# EAGLE design tricorder (EAGLE 6.4)
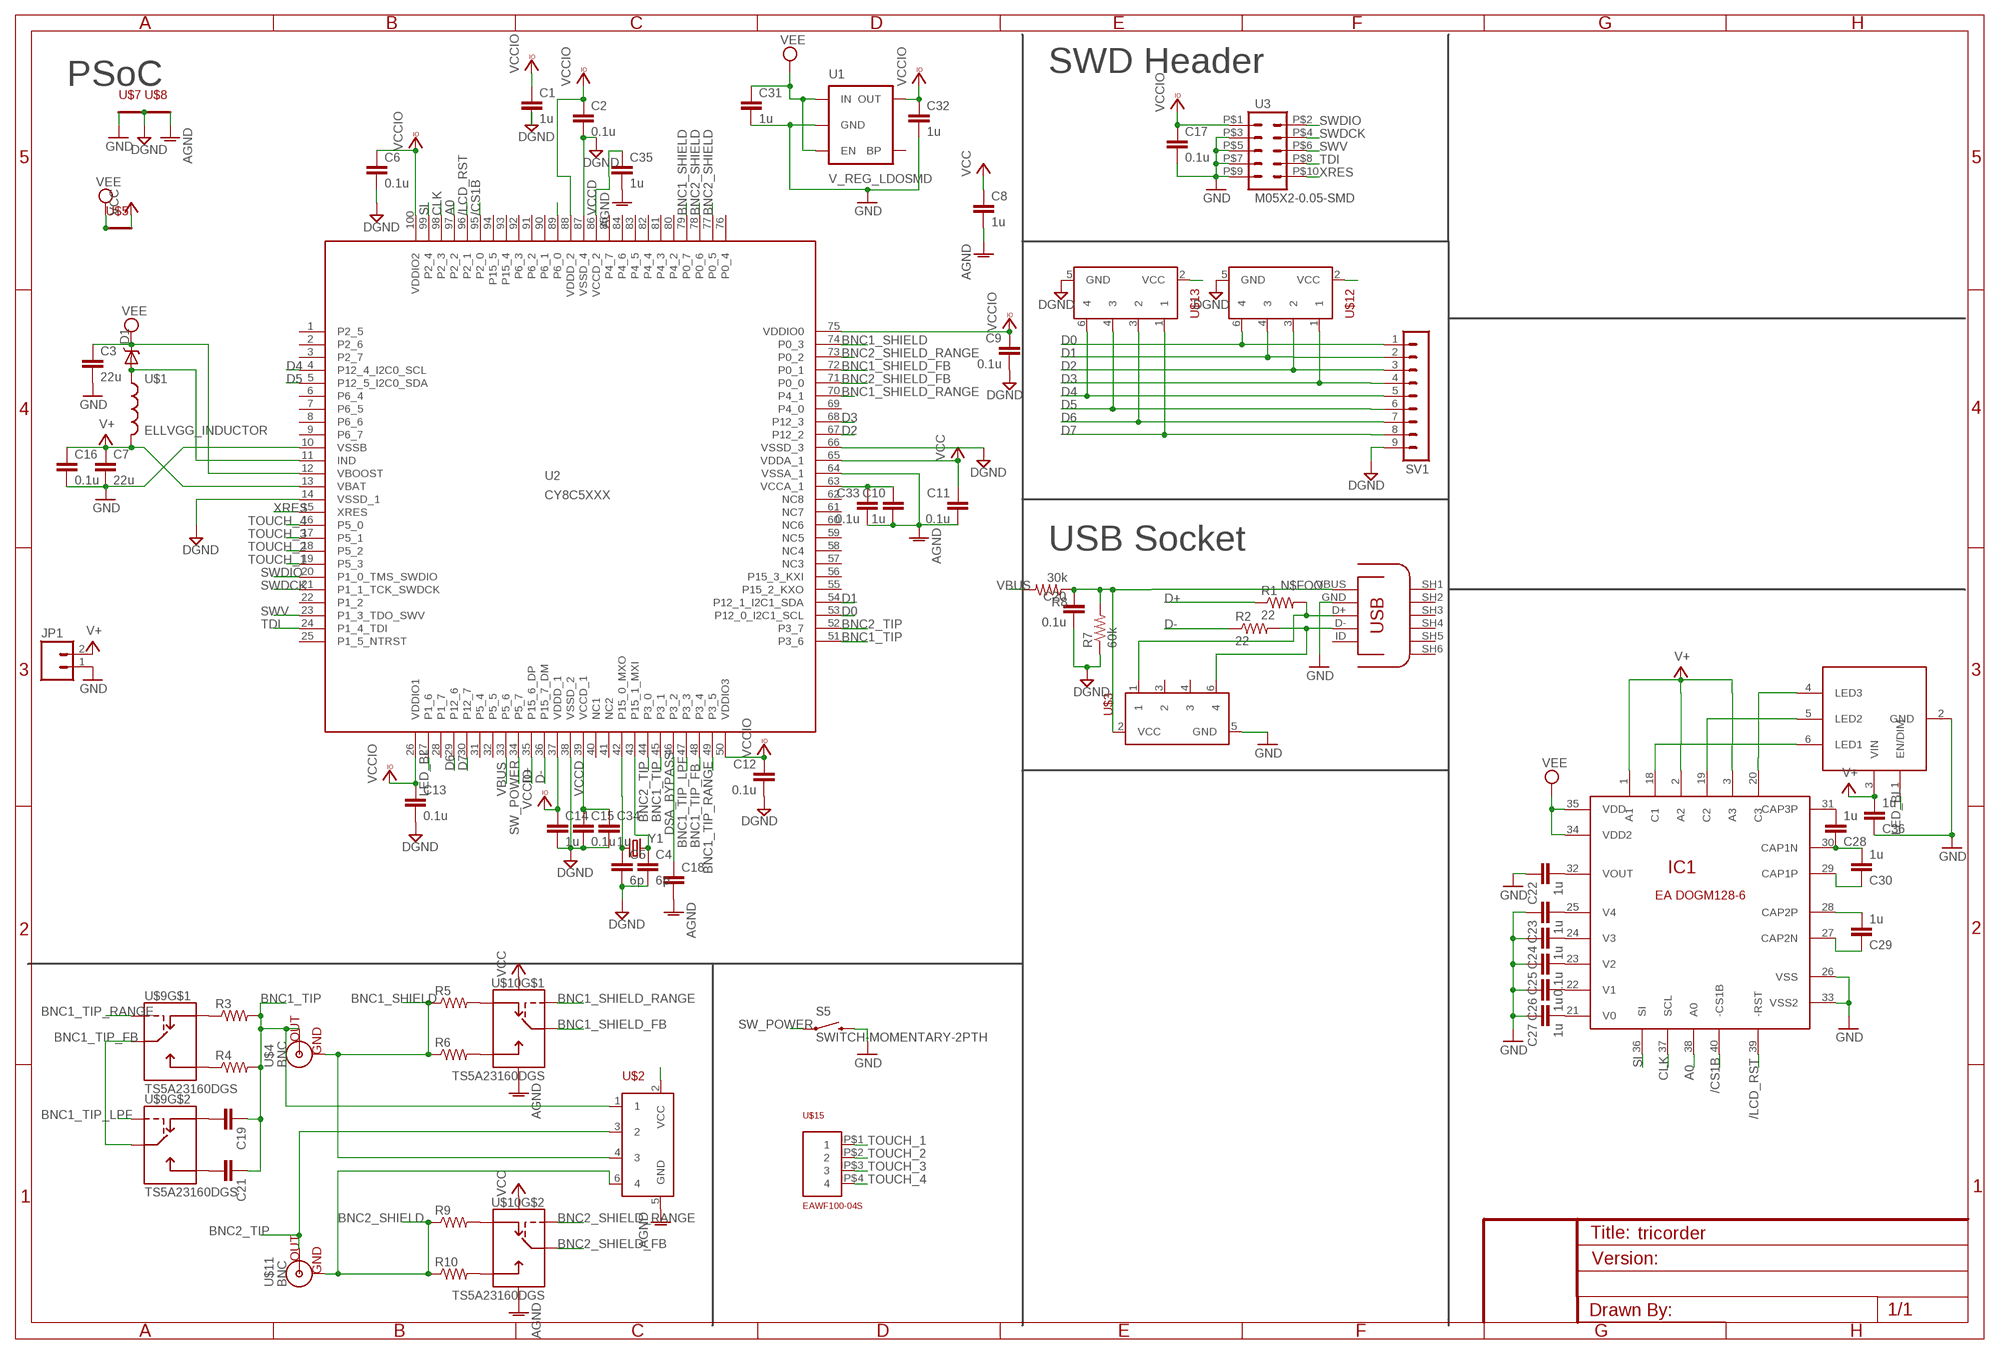
[diagram p0: schematic, sheet 1]

## Parts
C1  1u  CAP0603-CAP  [0603-CAP]
C2  0.1u  CAP0603-CAP  [0603-CAP]
C3  22u  CAP0805  [0805]
C4  6p  CAP0603-CAP  [0603-CAP]
C5  6p  CAP0603-CAP  [0603-CAP]
C6  0.1u  C-EUC0603K  [C0603K]
C7  22u  CAP0805  [0805]
C8  1u  CAP0603-CAP  [0603-CAP]
C9  0.1u  CAP0603-CAP  [0603-CAP]
C10  1u  CAP0603-CAP  [0603-CAP]
C11  0.1u  CAP0603-CAP  [0603-CAP]
C12  0.1u  C-EUC0603K  [C0603K]
C13  0.1u  C-EUC0603K  [C0603K]
C14  1u  CAP0603-CAP  [0603-CAP]
C15  0.1u  CAP0603-CAP  [0603-CAP]
C16  0.1u  CAP0603-CAP  [0603-CAP]
C17  0.1u  C-EUC0603K  [C0603K]
C18  CAP0805  [0805]
C19  CAP0603-CAP  [0603-CAP]
C20  0.1u  CAP0603-CAP  [0603-CAP]
C21  CAP0603-CAP  [0603-CAP]
C22  1u  C-EUC0603K  [C0603K]
C23  1u  C-EUC0603K  [C0603K]
C24  1u  C-EUC0603K  [C0603K]
C25  0.1u  C-EUC0603K  [C0603K]
C26  1u  C-EUC0603K  [C0603K]
C27  1u  C-EUC0603K  [C0603K]
C28  1u  C-EUC0603K  [C0603K]
C29  1u  C-EUC0603K  [C0603K]
C30  1u  C-EUC0603K  [C0603K]
C31  1u  CAP0603-CAP  [0603-CAP]
C32  1u  CAP0603-CAP  [0603-CAP]
C33  0.1u  CAP0603-CAP  [0603-CAP]
C34  1u  CAP0603-CAP  [0603-CAP]
C35  1u  CAP0603-CAP  [0603-CAP]
C36  1u  C-EUC0603K  [C0603K]
D1  DIODE-SCHOTTKY_  [SMA-DIODE]
IC1  EADOGM128  [EADOGM128]
JP1  M02PTH  [1X02]
R1  22  RESISTOR0603-RES  [0603-RES]
R2  22  RESISTOR0603-RES  [0603-RES]
R3  RESISTOR0603-RES  [0603-RES]
R4  RESISTOR0603-RES  [0603-RES]
R5  RESISTOR0603-RES  [0603-RES]
R6  RESISTOR0603-RES  [0603-RES]
R7  60k  RESISTOR0603-RES  [0603-RES]
R8  30k  RESISTOR0603-RES  [0603-RES]
R9  RESISTOR0603-RES  [0603-RES]
R10  RESISTOR0603-RES  [0603-RES]
S5  SWITCH-MOMENTARY-2PTH  [TACTILE-PTH]
SV1  MA09-1W  [MA09-1W]
U1  V_REG_LDOSMD  [SOT23-5]
U2  CY8C5XXX  CY8C3XXX-100PIN  [TQFP-14X14-100]
U3  M05X2-0.05-SMD  [PINHD-2X5-0.05-SMD]
U7  MICROUSB  [USB-MICROB]
U$1  ELLVGG_INDUCTOR  [ELLVGG_INDUCTOR]
U$2  ESD5V3U4RRSSOT363  [SOT363_INFINEON]
U$3  ESD5V3U4RRSSOT363  [SOT363_INFINEON]
U$4  BNC  [BNC_RA]
U$5  SHORT-2  [SHORT-2]
U$7  SHORT-2  [SHORT-2]
U$8  SHORT-2  [SHORT-2]
U$9  TS5A23160DGS  [MSOP10]
U$10  TS5A23160DGS  [MSOP10]
U$11  BNC  [BNC_RA]
U$12  ESD5V3U4RRSSOT363  [SOT363_INFINEON]
U$13  ESD5V3U4RRSSOT363  [SOT363_INFINEON]
U$15  EAWF100-04S  [EAWF100-04S]
U$16  CAT4003B  [SOT23-6]
Y1  XRCGB_XTAL  [XRCGB-XTAL]

## Nets
/CS1B: IC1.40(-CS1B) U2.95(P2_0)
/LCD_RST: IC1.39(-RST) U2.96(P2_1)
A0: IC1.38(A0) U2.97(P2_2)
AGND: C8.2 C10.2 C11.2 C18.2 C33.2 C35.2 U2.64(VSSA_1) U$2.5(GND) U$8.P$2 U$9.3(GND) U$10.3(GND)
BNC1_SHIELD: R5.1 R6.1 U2.74(P0_3) U2.79(P0_7) U$2.4 U$4.SHIELD_1(GND) U$4.SHIELD_2(GND)
BNC1_SHIELD_FB: U2.72(P0_1) U$10.10(COM)
BNC1_SHIELD_RANGE: U2.70(P4_1) U$10.1(IN)
BNC1_TIP: C19.1 C21.1 R3.2 R4.2 U2.45(P3_1) U2.51(P3_6) U$2.1 U$4.TIP(OUT)
BNC1_TIP_FB: U2.48(P3_4) U$9.6(COM) U$9.10(COM)
BNC1_TIP_LPF: U2.47(P3_3) U$9.5(IN)
BNC1_TIP_RANGE: U2.49(P3_5) U$9.1(IN)
BNC2_SHIELD: R9.1 R10.1 U2.77(P0_5) U2.78(P0_6) U$2.6 U$11.SHIELD_1(GND) U$11.SHIELD_2(GND)
BNC2_SHIELD_FB: U2.71(P0_0) U$10.6(COM)
BNC2_SHIELD_RANGE: U2.73(P0_2) U$10.5(IN)
BNC2_TIP: U2.44(P3_0) U2.52(P3_7) U$2.3 U$11.TIP(OUT)
CLK: IC1.37(SCL) U2.98(P2_3)
CLKI: C4.1 U2.43(P15_1_MXI) Y1.2
CLKO: C5.1 U2.42(P15_0_MXO) Y1.1
D0: SV1.1 U2.53(P12_0_I2C1_SCL) U$12.6
D1: SV1.2 U2.54(P12_1_I2C1_SDA) U$12.4
D2: SV1.3 U2.67(P12_2) U$12.3
D3: SV1.4 U2.68(P12_3) U$12.1
D4: SV1.5 U2.4(P12_4_I2C0_SCL) U$13.6
D5: SV1.6 U2.5(P12_5_I2C0_SDA) U$13.4
D6: SV1.7 U2.29(P12_6) U$13.3
D7: SV1.8 U2.30(P12_7) U$13.1
D+: R1.1 U2.35(P15_6_DP)
D+IN: R1.2 U7.D+ U$3.1
D-: R2.1 U2.36(P15_7_DM)
D-IN: R2.2 U7.D- U$3.6
DGND: C1.2 C2.2 C4.2 C5.2 C6.2 C9.2 C12.2 C13.2 C14.2 C15.2 C20.2 C34.2 R7.1 SV1.9 U2.14(VSSD_1) U2.38(VSSD_2) U2.66(VSSD_3) U2.87(VSSD_4) U$7.P$2 U$8.P$1 U$12.5(GND) U$13.5(GND)
DSA_BYPASS: C18.1 U2.46(P3_2)
GND: C3.2 C7.2 C16.2 C17.2 C22.1 C23.1 C24.1 C25.1 C26.1 C27.1 C31.2 C32.2 C36.1 IC1.26(VSS) IC1.33(VSS2) JP1.1 S5.3 U1.2(GND) U2.10(VSSB) U3.P$3 U3.P$5 U3.P$7 U3.P$9 U7.GND U$3.5(GND) U$7.P$1 U$16.2(GND)
LED_BL: U2.27(P1_6) U$16.1(EN/DIM)
N$1: R3.1 U$9.9(NC)
N$2: R4.1 U$9.2(NO)
N$3: C10.1 C33.1 U2.63(VCCA_1)
N$4: R5.2 U$10.9(NC)
N$5: R6.2 U$10.2(NO)
N$6: C19.2 U$9.7(NC)
N$7: C21.2 U$9.4(NO)
N$8: R9.2 U$10.7(NC)
N$9: R10.2 U$10.4(NO)
N$10: C22.2 IC1.32(VOUT)
N$11: C23.2 IC1.25(V4)
N$12: C24.2 IC1.24(V3)
N$13: C25.2 IC1.23(V2)
N$14: C26.2 IC1.22(V1)
N$15: C27.2 IC1.21(V0)
N$16: C28.1 C30.2 IC1.30(CAP1N)
N$17: C28.2 IC1.31(CAP3P)
N$18: C30.1 IC1.29(CAP1P)
N$19: C29.2 IC1.28(CAP2P)
N$21: C29.1 IC1.27(CAP2N)
N$22: IC1.18(C1) U$16.6(LED1)
N$23: IC1.19(C2) U$16.5(LED2)
N$25: IC1.20(C3) U$16.4(LED3)
N$26: D1.A U2.11(IND) U$1.P$1
N$FOO: C20.1 R7.2 R8.1 U7.VBUS(VCC) U$3.2(VCC)
NC1: U$13.2(VCC)
NC2: U$12.2(VCC)
NC3: U$2.2(VCC)
SI: IC1.36(SI) U2.99(P2_4)
SW_MENU: U2.89(P6_0)
SW_POWER: S5.1 U2.34(P5_7)
SWDCK: U2.21(P1_1_TCK_SWDCK) U3.P$4
SWDIO: U2.20(P1_0_TMS_SWDIO) U3.P$2
SWV: U2.23(P1_3_TDO_SWV) U3.P$6
TDI: U2.24(P1_4_TDI) U3.P$8
TOUCH_1: U2.19(P5_3) U$15.P$1
TOUCH_2: U2.18(P5_2) U$15.P$2
TOUCH_3: U2.17(P5_1) U$15.P$3
TOUCH_4: U2.16(P5_0) U$15.P$4
V+: C7.1 C16.1 C36.2 IC1.1(A1) IC1.2(A2) IC1.3(A3) JP1.2 U2.13(VBAT) U$1.P$2 U$16.3(VIN)
VBUS: R8.2 U2.33(P5_6)
VCC: C8.1 C11.1 U2.65(VDDA_1) U$5.P$2 U$9.8(VCC) U$10.8(VCC)
VCCD: C15.1 C34.1 C35.1 U2.39(VCCD_1) U2.86(VCCD_2)
VCCIO: C1.1 C2.1 C6.1 C9.1 C12.1 C13.1 C14.1 C17.1 C32.1 U1.5(OUT) U2.26(VDDIO1) U2.37(VDDD_1) U2.50(VDDIO3) U2.75(VDDIO0) U2.88(VDDD_2) U2.100(VDDIO2) U3.P$1
VEE: C3.1 C31.1 D1.C IC1.34(VDD2) IC1.35(VDD) U1.1(IN) U1.3(EN) U2.12(VBOOST) U$5.P$1
XRES: U2.15(XRES) U3.P$10
Unconnected: U1.4(BP) U2.1(P2_5) U2.2(P2_6) U2.3(P2_7) U2.6(P6_4) U2.7(P6_5) U2.8(P6_6) U2.9(P6_7) U2.22(P1_2) U2.25(P1_5_NTRST) U2.28(P1_7) U2.31(P5_4) U2.32(P5_5) U2.40(NC1) U2.41(NC2) U2.55(P15_2_KXO) U2.56(P15_3_KXI) U2.57(NC3) U2.58(NC4) U2.59(NC5) U2.60(NC6) U2.61(NC7) U2.62(NC8) U2.69(P4_0) U2.76(P0_4) U2.80(P4_2) U2.81(P4_3) U2.82(P4_4) U2.83(P4_5) U2.84(P4_6) U2.85(P4_7) U2.90(P6_1) U2.91(P6_2) U2.92(P6_3) U2.93(P15_4) U2.94(P15_5) U7.ID U7.SH1(SH) U7.SH2(SH) U7.SH3(SH) U7.SH4(SH) U7.SH5(SH) U7.SH6(SH) U$3.3 U$3.4

## Notes on the sheet
- SWD Header
- PSoC
- USB Socket

## Library data of the parts
C1-C5 C7-C11 C14-C16 C18-C21 C31-C35 = SparkFun-Passives:CAP: Capacitor Standard 0603 ceramic capacitor, and 0.1" leaded capacitor.
C6 C12 C13 C17 C22-C30 C36 = resistor:C-EU: CAPACITOR, European symbol
D1 = SparkFun-DiscreteSemi:DIODE-SCHOTTKY: Commonly MBRA140.
IC1 = ea-dogm:EADOGM128
JP1 = SparkFun-Connectors:M02: Header 2 Standard 2-pin 0.1" header. Use with straight break away headers (SKU : PRT-00116), right angle break away headers (PRT-00553), swiss pins (PRT-00743), machine pins (PRT-00117), and female headers (PRT-00115). Molex polarized connector foot print use with SKU : PRT-08233 with associated crimp pins and housings.
R1-R10 = SparkFun-Passives:RESISTOR: Resistor Basic schematic elements and footprints for 0603, 1206, and PTH resistors.
S5 = SparkFun-Electromechanical:SWITCH-MOMENTARY-2: Various NO switches- pushbuttons, reed, etc
SV1 = con-lstb:MA09-1W: PIN HEADER; OC_FARNELL: unknown; OC_NEWARK: unknown
U1 = SparkFun-PowerIC:V_REG_LDO: Voltage Regulator LDO Standard 150mA LDO voltage regulator in SOT-23 layout. Micrel part MIC5205. BP (by-pass) pin is used to lower output noise with 470pF cap.
U2 = cypress_psoc_V1_0:CY8C3XXX-100PIN: Cypress PSoC® 3 - Programmable System on Chip, 8051 Based Source Data: http://www.cypress.com/?mpn=CY8C3866AXI-040T LBR Source: http://www.westmarkelectronics.com Thomas W. Moxon Director of Engineering www.westmarkelectronics.com; MPN: CY8C3866AXI-040
U3 = nickparts:M05X2-0.05-SMD
U7 = ondraster:MICROUSB
U$1 = Ava:ELLVGG_INDUCTOR
U$2 U$3 U$12 U$13 = nickparts:ESD5V3U4RRS
U$4 U$11 = nickparts:BNC
U$5 U$7 U$8 = nickparts:SHORT-2
U$9 U$10 = nickparts:TS5A23160
U$15 = ea-dogm:EAWF100-04S
U$16 = nickparts:CAT4003B
Y1 = nickparts:XRCGB_XTAL

## Board
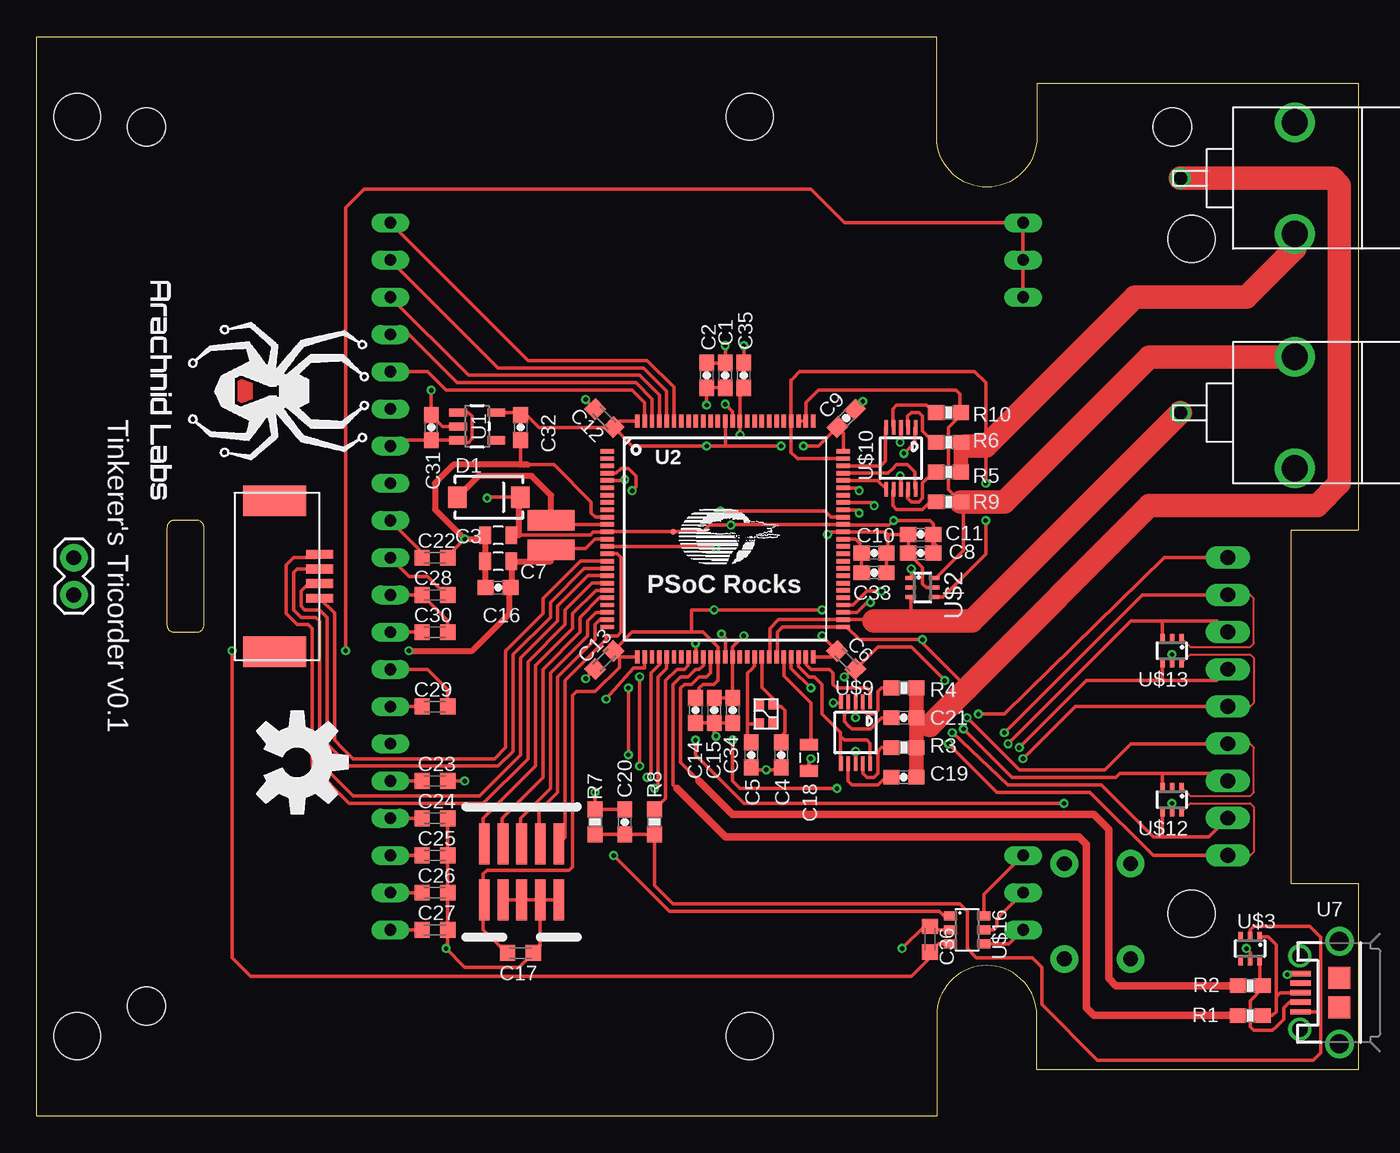
[diagram p1: board, top side]
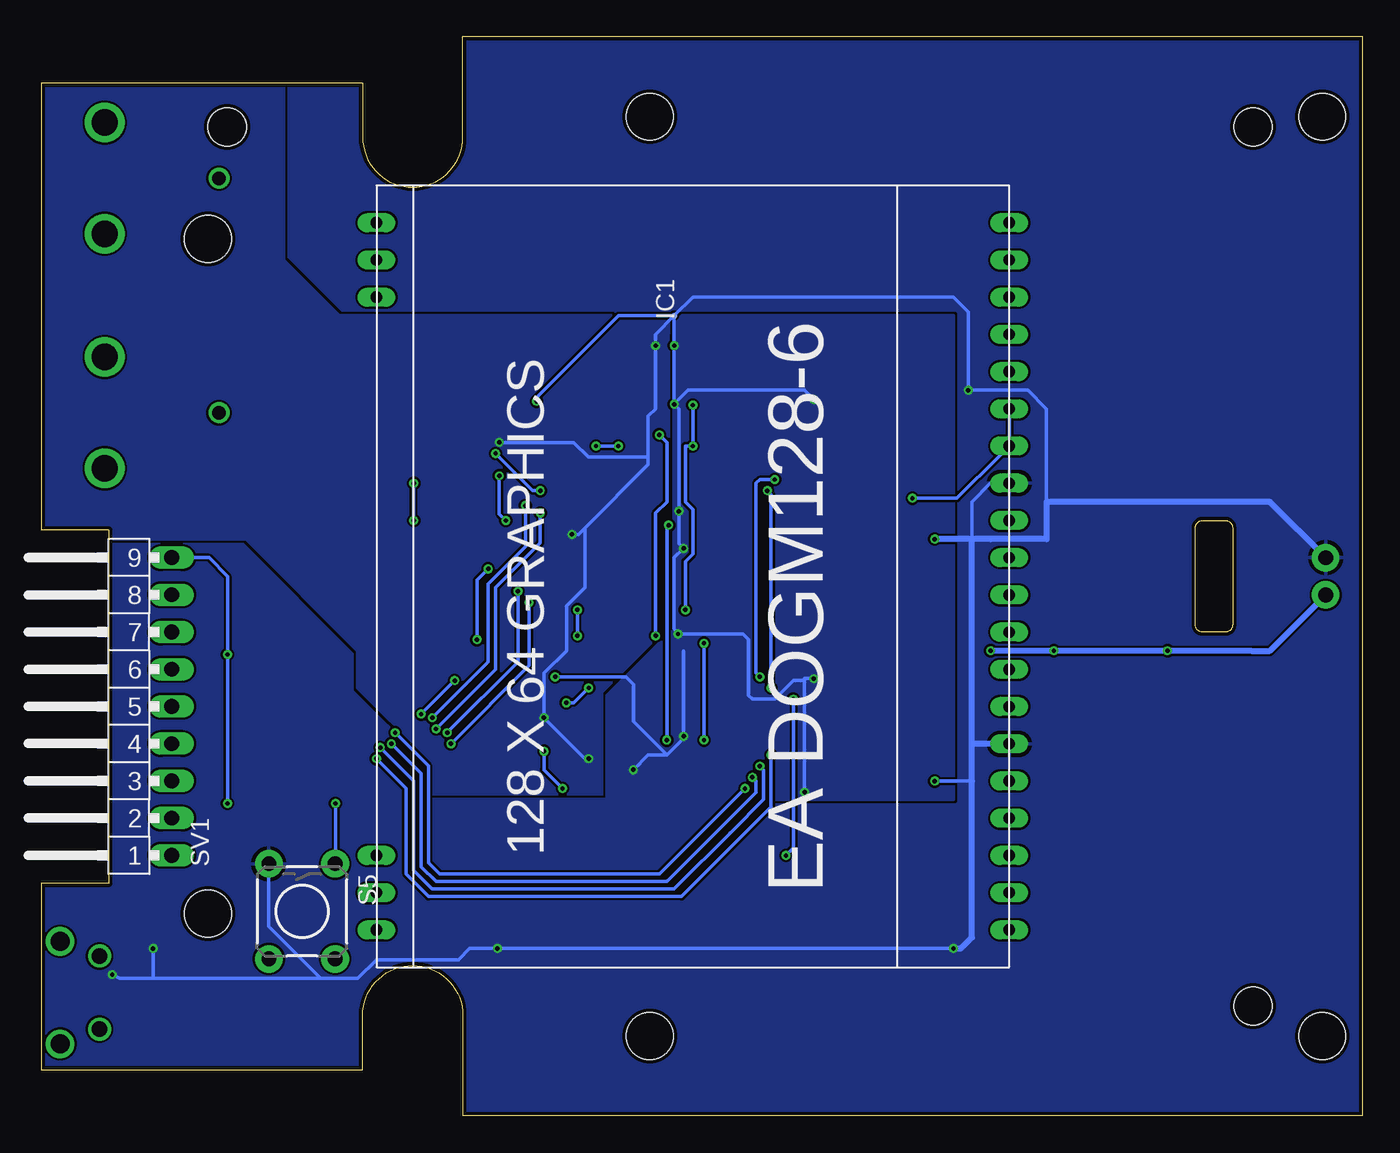
[diagram p2: board, bottom side, seen from below]

Size 90.17 x 73.66 mm. Coordinates in mm from the lower left corner, seen from the top.
Outline: 0,73.66 61.42,73.66 61.42,66.8 arc90 64.84,63.38 arc90 68.26,66.8 68.26,70.48 90.17,70.48 90.17,40.01 85.6,40.01 85.6,15.88 90.17,15.88 90.17,3.17 68.26,3.17 68.26,6.85 arc90 64.84,10.27 arc90 61.42,6.85 61.42,0 0,0 0,73.66
Outline: 8.89,40.14 8.89,33.52 arc90 9.39,33.02 10.93,33.02 arc90 11.43,33.52 11.43,40.14 arc90 10.93,40.64 9.39,40.64 arc90 8.89,40.14
Copper layers (1*16): Top 0.035mm / dielectric 1.5mm / Bottom 0.035mm
Design rules "Fusion_eagle_rule_v1.1 *": minimum track width 6mil, minimum drill 0.3mm, track to track 6mil, track to pad 6mil, pad to pad 6mil, via to via 6mil, smd to smd 0mil, copper to edge 10mil, drill to drill 10mil, minimum pad ring 10mil, minimum via ring 6mil, stop-mask expansion 2mil, vias tented up to drill 100mil, thermal gap 10mil
Holes 3.2 mm at 78.8,59.85 78.8,13.8 48.66,68.2 48.66,5.45 2.77,68.2 2.77,5.45
tKeepout: area 76.3,57.4 to 81.3,62.4; area 76.3,11.3 to 81.3,16.3; area 46.2,3 to 51.2,8; area 46.2,65.7 to 51.2,70.7; area 0.3,65.7 to 5.3,70.7; area 0.3,3 to 5.3,8

### Footprints (pad centres in the part's own frame; a part is rotated, then mirrored left to right if it is on the bottom)
0603-CAP = smd 1.1 x 1: 1 -0.85,0; 2 0.85,0
0805 = smd 0.8 x 1.2: 1 -0.9,0; 2 0.9,0
C0603K = smd 1.05 x 1.08: 1 -0.875,0; 2 0.875,0
SMA-DIODE = smd 1.27 x 1.47: A -2.15,0; C 2.15,0
EADOGM128 = drill 0.8 long: 1 -25.4,-21.59; 2 -22.86,-21.59; 3 -20.32,-21.59; 18 17.78,-21.59; 19 20.32,-21.59; 20 22.86,-21.59; 21 22.86,21.59; 22 20.32,21.59; 23 17.78,21.59; 24 15.24,21.59; 25 12.7,21.59; 26 10.16,21.59; 27 7.62,21.59; 28 5.08,21.59; 29 2.54,21.59; 30 0,21.59; 31 -2.54,21.59; 32 -5.08,21.59; 33 -7.62,21.59; 34 -10.16,21.59; 35 -12.7,21.59; 36 -15.24,21.59; 37 -17.78,21.59; 38 -20.32,21.59; 39 -22.86,21.59; 40 -25.4,21.59
1X02 = drill 1.016 pad 1.88: 1 0,0; 2 2.54,0
0603-RES = smd 1.1 x 1: 1 -0.85,0; 2 0.85,0
TACTILE-PTH = drill 1.016 pad 1.88: 1 -3.251,2.261; 2 3.251,2.261; 3 -3.251,-2.261; 4 3.251,-2.261
MA09-1W = drill 1.016 long: 1 -10.16,0; 2 -7.62,0; 3 -5.08,0; 4 -2.54,0; 5 0,0; 6 2.54,0; 7 5.08,0; 8 7.62,0; 9 10.16,0
SOT23-5 = smd 0.55 x 1.2: 1 -0.95,-1.3; 2 0,-1.3; 3 0.95,-1.3; 4 0.95,1.3; 5 -0.95,1.3
TQFP-14X14-100 = smd 0.9 x 0.3: 1 -8.05,6; 2 -8.05,5.5; 3 -8.05,5; 4 -8.05,4.5; 5 -8.05,4; 6 -8.05,3.5; 7 -8.05,3; 8 -8.05,2.5; 9 -8.05,2; 10 -8.05,1.5; 11 -8.05,1; 12 -8.05,0.5; 13 -8.05,0; 14 -8.05,-0.5; 15 -8.05,-1; 16 -8.05,-1.5; 17 -8.05,-2; 18 -8.05,-2.5; 19 -8.05,-3; 20 -8.05,-3.5; 21 -8.05,-4; 22 -8.05,-4.5; 23 -8.05,-5; 24 -8.05,-5.5; 25 -8.05,-6; 51 8.05,-6; 52 8.05,-5.5; 53 8.05,-5; 54 8.05,-4.5; 55 8.05,-4; 56 8.05,-3.5; 57 8.05,-3; 58 8.05,-2.5; 59 8.05,-2; 60 8.05,-1.5; 61 8.05,-1; 62 8.05,-0.5; 63 8.05,0; 64 8.05,0.5; 65 8.05,1; 66 8.05,1.5; 67 8.05,2; 68 8.05,2.5; 69 8.05,3; 70 8.05,3.5; 71 8.05,4; 72 8.05,4.5; 73 8.05,5; 74 8.05,5.5; 75 8.05,6 | smd 0.3 x 0.9: 26 -6,-8.05; 27 -5.5,-8.05; 28 -5,-8.05; 29 -4.5,-8.05; 30 -4,-8.05; 31 -3.5,-8.05; 32 -3,-8.05; 33 -2.5,-8.05; 34 -2,-8.05; 35 -1.5,-8.05; 36 -1,-8.05; 37 -0.5,-8.05; 38 0,-8.05; 39 0.5,-8.05; 40 1,-8.05; 41 1.5,-8.05; 42 2,-8.05; 43 2.5,-8.05; 44 3,-8.05; 45 3.5,-8.05; 46 4,-8.05; 47 4.5,-8.05; 48 5,-8.05; 49 5.5,-8.05; 50 6,-8.05; 76 6,8.05; 77 5.5,8.05; 78 5,8.05; 79 4.5,8.05; 80 4,8.05; 81 3.5,8.05; 82 3,8.05; 83 2.5,8.05; 84 2,8.05; 85 1.5,8.05; 86 1,8.05; 87 0.5,8.05; 88 0,8.05; 89 -0.5,8.05; 90 -1,8.05; 91 -1.5,8.05; 92 -2,8.05; 93 -2.5,8.05; 94 -3,8.05; 95 -3.5,8.05; 96 -4,8.05; 97 -4.5,8.05; 98 -5,8.05; 99 -5.5,8.05; 100 -6,8.05
PINHD-2X5-0.05-SMD = smd 2.794 x 0.737: P$1 1.27,5.08; P$2 5.08,5.08; P$3 1.27,3.81; P$4 5.08,3.81; P$5 1.27,2.54; P$6 5.08,2.54; P$7 1.27,1.27; P$8 5.08,1.27; P$9 1.27,0; P$10 5.08,0
USB-MICROB = smd 0.35 x 1.4: D+ 0,2.65; D- -0.65,2.65; GND 1.3,2.65; ID 0.65,2.65; VBUS -1.3,2.65 | drill 1.3 pad 1.6: SH1 -3.5,0; SH2 3.5,0 | drill 1.05 pad 1.4: SH3 2.5,2.7; SH4 -2.5,2.7 | smd 1.5 x 1.5: SH5 -1,0; SH6 1,0
ELLVGG_INDUCTOR = smd 1.4 x 3.2: P$1 -0.953,0; P$2 1.048,0
SOT363_INFINEON = smd 0.3 x 0.7: 1 -0.65,-0.8; 2 0,-0.8; 3 0.65,-0.8; 4 0.65,0.8; 5 0,0.8; 6 -0.65,0.8
BNC_RA = drill 1.8: SHIELD_1 -3.8,0; SHIELD_2 3.8,0 | drill 0.92: TIP 0,7.8
SHORT-2 = smd 0.406 x 0.406: P$1 0,0; P$2 0,0
MSOP10 = smd 0.25 x 1: 1 -1,-2.113; 2 -0.5,-2.113; 3 0,-2.113; 4 0.5,-2.113; 5 1,-2.113; 6 1,2.113; 7 0.5,2.113; 8 0,2.113; 9 -0.5,2.113; 10 -1,2.113
EAWF100-04S = smd 0.6 x 1.85: P$1 -1.5,0; P$2 -0.5,0; P$3 0.5,0; P$4 1.5,0 | smd 2.1 x 4.3: SHIELD-1 -5.15,-3.075; SHIELD-2 5.15,-3.075
SOT23-6 = smd 0.6 x 0.9: 1 -0.95,-1.15; 2 0,-1.15; 3 0.95,-1.15; 4 0.95,1.15; 5 0,1.15; 6 -0.95,1.15
STENCIL8_FIDUCIAL = hole 2.6: 0,0
XRCGB-XTAL = smd 0.75 x 0.7: 1 -0.675,0.5; 2 0.675,-0.5; NC1 0.675,0.5; NC2 -0.675,-0.5

### Placement (x,y rotation side)
C1  46.99,50.55 90 top
C2  45.72,50.55 90 top
C3  31.5,39.62 180 top
C4  50.8,24.64 270 top
C5  48.77,24.64 270 top
C6  55.24,31.11 315 top
C7  31.5,37.85 180 top
C8  60.33,38.42 180 top
C9  55.24,47.62 45 top
C10  57.15,38.42 0 top
C11  60.33,39.69 180 top
C12  38.73,47.62 135 top
C13  38.73,31.11 225 top
C14  44.96,27.69 270 top
C15  46.23,27.69 270 top
C16  31.5,36.07 180 top
C17  33.01,11.12 0 top
C18  52.7,24.45 270 top
C19  59.18,23.11 180 top
C20  40.13,20.07 90 top
C21  59.18,27.18 180 top
C22  27.18,38.1 180 top
C23  27.18,22.86 180 top
C24  27.18,20.32 180 top
C25  27.18,17.78 180 top
C26  27.18,15.24 180 top
C27  27.18,12.7 180 top
C28  27.18,35.56 0 top
C29  27.18,27.94 0 top
C30  27.18,33.02 0 top
C31  26.92,46.99 90 top
C32  33.02,46.99 270 top
C33  57.15,37.08 0 top
C34  47.5,27.69 270 top
C35  48.26,50.55 90 top
C36  60.96,12.06 270 top
D1  30.86,42.23 0 top
IC1  45.72,35.56 270 bottom
JP1  2.54,38.1 270 top
R1  82.8,6.86 0 top
R2  82.8,8.89 0 top
R3  59.18,25.15 0 top
R4  59.18,29.21 0 top
R5  62.23,43.94 180 top
R6  62.23,45.97 180 top
R7  38.1,20.07 270 top
R8  42.16,20.07 90 top
R9  62.23,41.91 180 top
R10  62.23,48.01 180 top
S5  72.39,13.97 270 bottom
SV1  81.28,27.95 90 bottom
U1  30.06,47.06 270 top
U2  46.99,39.37 0 top
U3  35.64,13.49 90 top
U7  88.9,8.42 90 top
U$1  35.12,39.69 270 top
U$2  60.45,36.07 270 top
U$3  82.8,11.43 180 top
U$4  85.85,64 90 top
U$5  43.43,39.88 0 top
U$6  [ARACHNID_LABS_LOGO]  17.78,49.53 270 top
U$7  46.99,54.61 0 bottom
U$8  46.99,54.61 0 bottom
U$9  55.88,26.16 180 top
U$10  58.98,44.89 180 top
U$11  85.85,48 90 top
U$12  77.47,21.59 180 top
U$13  77.47,31.75 180 top
U$14  [OSHW-LOGO-L]  17.78,24.13 270 top
U$15  19.3,36.83 270 top
U$16  63.5,12.7 270 top
U$17  [STENCIL8_FIDUCIAL]  77.5,67.5 0 top
U$18  [STENCIL8_FIDUCIAL]  7.5,67.5 0 top
U$19  [STENCIL8_FIDUCIAL]  7.5,7.5 0 top
Y1  49.78,27.43 90 top

### Tracks (layer width: path | path; a pad name or v marks a point on that pad's centre or on a via)
/CS1B
  Top 0.254: U2.95 43.49,49.73 41.66,51.56 33.53,51.56 IC1.40
/LCD_RST
  Top 0.254: U2.96 42.99,49.47 41.4,51.05 31.5,51.05 IC1.39
A0
  Top 0.254: U2.97 42.49,49.2 41.15,50.55 29.46,50.55 IC1.38
AGND  (via drill 0.3, 0.3 pad 0.6)
  Top 0.254: v53.98,39.69 54.16,39.87 U2.64 57.92,39.87 | 57.92,39.87 58.1,39.69 | 58.1,39.69 58.1,38.49 C10.2 C33.2 | 58.1,39.69 C11.2 C8.2 60.45,37.42 60.45,36.32 60.71,36.07 U$2.5 | 58.1,39.69 57.92,39.87 | U$10.3 58.98,46.02 v58.93,45.97 | U$9.3 v55.88,27.18 | C18.2 52.7,24.26 v52.83,24.38 | C35.2 v48.26,52.58
  Bottom 0.254: v58.93,45.97 53.85,45.97 52.83,44.96 48.77,44.96 | 48.77,44.96 48.77,44.45 | 48.77,44.45 48.77,44.96 | 48.77,44.96 48.77,45.21 48.77,47.75 48.26,48.26 48.26,52.07 v48.26,52.58 | 53.53,39.69 v53.98,39.69 53.53,39.69 | 53.53,39.69 53.09,40.13 | 53.09,40.13 48.77,44.45 | v52.83,24.38 53.09,24.38 v55.88,27.18 55.88,30.23 54.36,31.75 54.36,34.8 53.09,36.07 53.09,40.13 | U$8.P$2 48.26,53.34 48.26,52.83 | 48.26,52.83 v48.26,52.58 | v48.26,52.58 48.26,52.83 | 53.53,39.69 53.09,40.13
  pour Bottom (rank 2): 46.99,54.61 69.85,54.61 73.66,58.42 73.66,71.12 90.17,71.12 90.17,39.37 76.2,39.37 68.58,31.75 68.58,29.21 64.01,24.64 64.01,21.59 51.56,21.59 51.56,28.7 46.99,33.27
BNC1_SHIELD  (via drill 0.3)
  Top 0.254: 54.27,44.87 U2.74 51.9,44.87 51.82,44.96 51.49,45.28 U2.79 51.49,50.22 51.56,50.29 52.07,50.8 64.01,50.8 64.77,50.04 64.77,45.72 | U$2.4 61.33,35.42 61.83,35.42 64.77,38.35 64.77,38.86 v64.77,40.64 | v64.77,43.18 64.77,45.72 | R6.1 63.25,45.97 63.5,45.72 | 63.08,45.3 64.35,45.3 64.77,45.72
  Top 1: R5.1 63.08,45.3 63.5,45.72
  Top 1.6: U$4.SHIELD_1 85.85,59.18 82.55,55.88 74.93,55.88 64.77,45.72 63.5,45.72 63.33,45.72
  Bottom 0.254: v64.77,40.64 v64.77,43.18
BNC1_SHIELD_FB
  Top 0.254: U2.72 58.09,43.87 58.42,44.2 58.67,44.45 59.44,44.45 59.94,43.94 59.94,42.81 U$10.10
BNC1_SHIELD_RANGE  (via drill 0.3 pad 0.6)
  Top 0.254: U2.70 55.94,42.87 v56.13,42.67 | v59.18,45.21 59.94,45.97 59.94,46.97 U$10.1
  Bottom 0.254: v56.13,42.67 56.64,42.67 v59.18,45.21
BNC1_TIP  (via drill 0.3)
  Top 0.254: U2.45 50.55,31.38 50.55,33.02 50.9,33.37 U2.51 55.28,33.37 56.13,32.51 60.2,32.51 | 60.2,32.51 v60.45,32.51 | 60.2,32.51 63.5,29.21 | v59.69,37.34 59.69,36.76 U$2.1
  Top 1: R4.2 C21.1 60.03,26.67 | 60.03,26.67 R3.2 C19.1 | 60.96,26.67 60.03,26.67
  Top 1.6: 60.96,26.67 63.5,29.21 75.95,41.66 87.38,41.66 88.9,43.18 88.9,63.5 88.4,64 U$4.TIP
  Bottom 0.254: v60.45,32.51 60.45,36.58 v59.69,37.34
BNC1_TIP_FB
  Top 0.254: U2.48 51.99,30.69 52.7,29.97 53.09,29.97 53.59,29.46 53.59,27.43 54.86,26.16 54.86,25.91 | 54.86,25.91 54.86,24.07 U$9.6 | U$9.10 56.88,25.42 56.64,25.65 55.12,25.65 54.86,25.91
BNC1_TIP_LPF  (via drill 0.3)
  Top 0.254: U2.47 51.49,30.55 v52.83,29.21 | v54.36,28.19 54.8,28.19 U$9.5
  Bottom 0.254: v52.83,29.21 53.85,28.19 v54.36,28.19
BNC1_TIP_RANGE
  Top 0.254: U2.49 52.49,30.82 52.83,30.48 54.1,30.48 54.36,30.23 54.36,29.46 54.61,29.21 56.64,29.21 56.9,28.96 56.9,28.26 U$9.1
BNC2_SHIELD
  Top 0.254: U2.78 U2.77 52.49,48.68 53.34,49.53 62.74,49.53 62.99,49.28 62.99,48.09 R10.1 63.08,47.84 62.23,46.99 62.23,42.76 R9.1 63.25,41.74 63.25,38.61 61.36,36.72 U$2.6
  Top 1.6: R9.1 66.04,41.91 75.93,51.8 U$11.SHIELD_2
BNC2_SHIELD_FB
  Top 0.254: U2.71 57.38,43.37 U$10.6
BNC2_SHIELD_RANGE
  Top 0.254: U2.73 57.58,44.37 57.91,44.7 57.91,46.94 U$10.5
BNC2_TIP
  Top 0.254: U2.44 50.04,31.37 50.04,32.26 50.04,33.27 50.63,33.87 U2.52 56.55,33.87 57.15,33.78 | 59.69,33.78 59.4,34.07 59.65,34.33 U$2.3
  Top 1.6: 57.15,33.78 59.69,33.78 62.56,33.78 63.83,33.78 U$11.TIP
CLK
  Top 0.254: U2.98 41.99,48.94 40.89,50.04 28.7,50.04 25.4,53.34 IC1.37
CLKI
  Top 0.254: U2.43 49.49,29.25 50.28,28.46 Y1.2 50.45,27.94 50.8,27.94 51.05,27.69 51.05,26.16 50.8,25.91 C4.1
CLKO
  Top 0.254: U2.42 48.99,30.7 48.77,30.48 48.51,30.23 48.51,26.67 | 48.51,26.67 48.51,25.74 C5.1 | Y1.1 48.6,26.76 48.51,26.67
D0  (via drill 0.3)
  Top 0.152: U$12.6 78.19,20.79 78.74,21.34 82.8,21.34 83.06,21.08 83.06,18.03 82.8,17.78 SV1.1
  Top 0.254: v62.23,25.4 65.53,22.1 71.88,22.1 76.2,17.78 SV1.1 | v56.9,35.05 56.64,35.05 56.13,34.54 55.96,34.37 U2.53
  Bottom 0.254: v56.9,35.05 56.9,30.73 v62.23,25.4
D1  (via drill 0.3)
  Top 0.254: U2.54 55.7,34.87 56.64,35.81 v57.66,35.81 | v62.48,26.16 66.29,22.61 72.64,22.61 74.93,20.32 76.2,19.05 76.96,19.05 | SV1.2 80,19.05 76.96,19.05 | U$12.4 76.82,19.19 76.96,19.05
  Bottom 0.254: v57.66,35.81 57.66,31.24 57.66,30.99 v62.48,26.16
D2  (via drill 0.3, 0.3 pad 0.6)
  Top 0.254: U2.67 55.91,41.37 v56.13,41.15 | v63.25,26.42 66.55,23.11 73.66,23.11 73.91,23.37 76.71,23.37 | SV1.3 80.77,23.37 76.71,23.37 | U$12.3 76.82,23.26 76.71,23.37
  Bottom 0.254: v56.13,41.15 56.13,39.12 58.93,36.32 59.18,36.07 59.18,30.48 v63.25,26.42
D3  (via drill 0.3, 0.3 pad 0.6)
  Top 0.152: U$12.1 78.19,22.39 78.74,21.84 82.8,21.84 83.06,22.1 83.06,25.15 82.8,25.4 SV1.4
  Top 0.254: U2.68 56.94,41.87 v57.15,41.66 | v63.5,27.18 65.28,25.4 67.06,23.62 72.9,23.62 74.68,25.4 SV1.4
  Bottom 0.254: v57.15,41.66 57.15,38.86 59.69,36.32 59.69,30.99 v63.5,27.18
D4  (via drill 0.3)
  Top 0.152: U$13.6 78.19,30.95 78.74,31.5 82.8,31.5 83.06,31.24 83.06,28.19 82.8,27.94 SV1.5
  Top 0.254: U2.4 39.55,43.87 39.88,44.2 40.39,44.2 40.64,43.94 40.89,43.69 40.89,42.93 v40.64,42.67 | v40.39,29.21 v40.39,24.64 | v67.31,24.38 67.82,24.89 70.87,27.94 SV1.5
  Bottom 0.254: 40.39,29.46 v40.39,29.21 40.39,42.42 v40.64,42.67 | v40.39,24.64 40.39,21.08 43.18,18.29 46.48,14.99 63.75,14.99 65.28,16.51 65.28,18.03 65.28,22.35 v67.31,24.38
D5  (via drill 0.3)
  Top 0.254: U2.5 39.81,43.37 v40.13,43.43 | v41.15,29.97 v41.15,23.88 | v67.06,25.15 67.56,25.65 71.63,29.72 76.96,29.72 | 76.96,29.72 80.51,29.72 SV1.6 | U$13.4 76.82,29.86 76.96,29.72
  Bottom 0.254: v40.13,43.43 41.15,43.43 41.4,43.18 41.4,30.23 v41.15,29.97 | v41.15,23.88 40.89,23.62 40.89,21.59 43.05,19.43 | 43.05,19.43 43.18,19.3 | v67.06,25.15 64.77,22.86 64.77,17.78 64.77,16.76 63.5,15.49 46.99,15.49 43.05,19.43
D6  (via drill 0.3)
  Top 0.254: U2.29 42.49,30.81 41.91,30.23 41.91,23.37 v41.66,23.11 | v66.29,25.4 66.8,25.91 74.68,33.78 76.71,33.78 | 76.71,33.78 80.53,33.78 SV1.7 | U$13.3 76.82,33.67 76.71,33.78
  Bottom 0.254: v41.66,23.11 41.4,22.86 41.4,22.1 43.18,20.32 47.5,16 63.25,16 64.26,17.02 64.26,18.03 64.26,23.37 v66.29,25.4
D7  (via drill 0.3)
  Top 0.152: U$13.1 78.19,32.55 78.74,32 82.8,32 83.06,32.26 83.06,35.31 82.8,35.56 SV1.8
  Top 0.254: U2.30 42.99,30.54 42.42,29.97 42.42,22.61 v42.16,22.35 | v66.04,26.16 66.55,26.67 75.44,35.56 SV1.8
  Bottom 0.254: v42.16,22.35 43.43,21.08 48.01,16.51 62.74,16.51 62.99,16.51 63.75,17.27 63.75,23.88 v66.04,26.16
D+
  Top 0.254: U2.35 45.49,30.76 45.21,30.48 44.96,30.48 44.45,29.97 43.94,29.97 43.43,29.46 43.43,22.61 43.69,22.35
  Top 0.508: 43.69,22.35 46.99,19.05 71.12,19.05 71.63,18.54 71.63,7.37 72.14,6.86 R1.1
D+IN
  Top 0.254: U$3.1 84.04,12.23 84.58,11.68 84.58,8.13 | 84.58,8.13 84.58,7.87 84.58,7.11 84.33,6.86 R1.2 | U7.D+ 84.88,8.42 84.58,8.13
D-
  Top 0.254: U2.36 45.99,30.24 45.72,29.97 45.21,29.97 44.7,29.46 44.2,29.46 43.94,29.21 43.94,24.13 45.21,22.86
  Top 0.508: 45.21,22.86 47.5,20.57 72.14,20.57 73.15,19.56 73.15,9.4 73.66,8.89 R2.1
D-IN
  Top 0.254: U$3.6 83.45,9.09 R2.2 83.65,8.72 82.8,7.87 82.8,6.1 83.06,5.84 84.33,5.84 84.58,6.1 85.09,6.6 85.09,7.37 85.21,7.49 85.5,7.77 U7.D-
DGND  (via drill 0.3, 0.3 pad 0.6)
  Top 0.254: U2.87 47.49,48.08 v46.99,48.58 | U2.14 46.22,38.87 v46.35,38.73 | U2.66 54.19,40.87 53.78,41.27 v46.67,41.27 | C12.2 v37.47,48.9 | v56.39,48.77 C9.2 v56.39,48.77 | v56.39,48.77 56.52,48.9 | C13.2 v37.47,29.84 | C5.2 48.93,23.62 v49.78,23.62 50.63,23.62 C4.2 | C20.2 R7.1 v38.1,22.1 | U2.38 46.99,31.75 46.99,32.64 v46.74,32.89 | v55.12,29.97 55.64,30.5 C6.2 55.9,30.5 57.4,32 59.69,32 v61.98,29.72 | v46.99,52.58 C1.2 C2.2 | C14.2 C15.2 | C34.2 C15.2 | C15.2 46.23,26.04 v46.35,25.91 | U$12.5 v77.47,21.34 | v77.47,31.5 U$13.5 | v64.26,27.43 66.04,27.43 76.96,38.1 SV1.9 | SV1.9 | SV1.9 | SV1.9
  Bottom 0.254: 46.67,48.26 46.67,46.35 v46.67,41.27 46.67,39.05 v46.35,38.73 46.99,38.1 46.99,33.27 v46.74,32.89 42.29,32.89 41.91,32.51 41.91,28.7 41.66,28.45 40.13,28.45 38.86,29.72 38.1,29.72 | 46.67,48.26 v46.99,48.58 | 46.67,48.26 v46.99,48.58 | 46.35,25.78 v46.35,25.91 46.35,25.78 | 46.35,25.78 46.35,31.75 | v37.47,29.84 38.1,29.84 38.1,29.72 | v37.47,48.9 38.1,49.53 46.04,49.53 v46.99,48.58 | v49.78,23.62 49.91,23.5 v49.78,23.62 | 46.35,25.78 47.5,24.64 | 47.5,24.64 47.75,24.64 48.77,24.64 v49.78,23.62 | 46.99,53.34 U$8.P$1 50.8,54.61 56.39,49.02 v56.39,48.77 | 46.99,53.34 v46.99,52.58 | v46.99,52.58 v46.99,48.58 | v38.1,22.1 38.1,29.72 | v55.12,29.97 50.29,29.97 49.78,29.46 49.78,26.92 47.5,24.64 | v46.99,52.58 46.99,53.34 | v77.47,21.34 v77.47,31.5 77.47,36.83 | 78.74,38.1 78.75,38.11 SV1.9 | 78.74,38.1 77.47,36.83 | v61.98,29.72 v64.26,27.43 | 77.47,36.83 78.74,38.1
  pour Bottom: 46.99,54.61 27.94,54.61 27.94,21.59 43.18,21.59 48.26,16.51 63.88,16.51 63.88,21.59 51.56,21.59 51.56,28.7 47.24,33.02 46.99,33.02
DSA_BYPASS
  Top 0.254: U2.46 50.99,30.04 52.83,28.19 52.83,25.47 C18.1
GND  (via drill 0.3, 0.3 pad 0.6)
  Top 0.254: U1.2 27.7,47.06 C31.2 v26.92,49.53 | U2.10 38.12,40.87 37.85,41.15 37.85,41.91 35.31,44.45 33.27,44.45 | U3.P$9 U3.P$7 | U3.P$3 U3.P$5 U3.P$7 | C32.2 33.02,44.45 | C24.1 C25.1 C26.1 C27.1 28.05,11.54 v27.94,11.43 29.21,10.16 32.92,10.16 C17.2 34.37,11.6 U3.P$7 | C22.1 28.05,38.21 v29.21,39.37 | C23.1 v29.21,22.86 | U7.GND 85.38,9.69 v85.34,9.65 | U$3.5 82.8,11.18 v82.55,11.43 | v59.05,11.43 60.56,12.94 C36.1 61.2,12.7 U$16.2
  Top 0.406: 30.6,39.37 C3.2 30.6,39.37 | 30.6,39.37 C7.2 30.6,36.12 C16.2 | 30.6,39.37 v29.21,39.37 27.18,41.4 27.18,43.18 28.45,44.45 33.02,44.45 33.27,44.45 33.53,44.45
  Bottom 0.254: IC1.33 25.4,43.18 26.67,41.91 26.67,39.37 | 60.96,11.43 59.69,11.43 | 59.69,11.43 v59.05,11.43 | v59.05,11.43 58.42,11.43 | 58.42,11.43 29.21,11.43 | 29.21,11.43 v27.94,11.43 29.21,11.43 | U$7.P$1 45.72,55.88 27.94,55.88 26.92,54.86 v26.92,49.53 22.86,49.53 21.59,48.26 21.59,41.91 21.59,39.37 | 60.96,11.43 59.69,11.43 | v29.21,22.86 26.67,22.86 | v85.34,9.65 84.84,9.4 82.55,9.4 | 82.55,9.4 71.12,9.4 | 71.12,9.4 68.58,9.4 67.31,10.67 61.72,10.67 60.96,11.43 | v82.55,11.43 82.55,9.91 82.55,9.4 | S5.3 74.65,12.93 71.12,9.4 | v59.05,11.43 58.42,11.43
  Bottom 0.406: 26.67,39.37 25.4,39.37 21.59,39.37 21.59,41.91 6.35,41.91 JP1.1 | 26.67,39.37 v29.21,39.37 | v27.94,11.43 27.43,11.43 26.67,12.19 26.67,22.86 26.67,25.4 | 26.67,25.4 26.67,39.37 | IC1.26 26.67,25.4
  pour Bottom (rank 3): 0,73.66 90.17,73.66 90.17,0 0,0
LED_BL  (via drill 0.3 pad 0.6)
  Top 0.254: U2.27 41.49,30.57 40.73,30.57 v38.86,28.45 | v39.37,17.78 42.55,14.61 | 42.55,14.61 43.18,13.97 | U$16.1 61.91,13.65 61.59,13.97 43.18,13.97 | 43.18,13.97 42.55,14.61
  Bottom 0.254: v38.86,28.45 38.86,18.29 v39.37,17.78
N$1
  Top 0.254: R3.1 57.66,25.15 57.4,24.89 57.4,23.37 57.15,23.11 56.64,23.11 56.39,23.37 U$9.9
N$2
  Top 0.254: U$9.2 56.39,28.27 56.39,27.69 56.64,27.43 57.15,27.43 57.4,27.69 57.4,28.96 57.66,29.21 R4.1
N$3
  Top 0.254: U2.63 55.88,39.37 56.2,39.05 56.2,38.49 C10.1 C33.1
N$4
  Top 0.254: R5.2 61.21,43.94 60.45,43.18 60.45,42.16 60.2,41.91 59.69,41.91 59.44,42.16 59.44,42.73 U$10.9
N$5
  Top 0.254: R6.2 61.21,45.97 60.45,46.74 60.45,47.75 60.2,48.01 59.69,48.01 59.44,47.75 59.44,47.04 U$10.2
N$6
  Top 0.254: C19.2 57.91,23.11 57.4,22.61 55.63,22.61 55.37,22.86 U$9.7 | U$9.7
N$7
  Top 0.254: C21.2 57.66,27.18 56.9,26.42 55.63,26.42 55.37,26.67 55.12,26.92 55.12,27.43 55.37,27.69 55.37,28.27 | 55.37,28.27 U$9.4 55.37,28.27
N$8
  Top 0.254: R9.2 60.96,41.91 60.45,41.4 58.67,41.4 58.42,41.66 58.42,42.72 U$10.7
N$9
  Top 0.254: R10.2 61.21,48.01 60.71,48.51 58.67,48.51 58.42,48.26 58.42,47.06 U$10.4
N$10
  Top 0.254: C22.2 26.3,38.47 IC1.32
N$11
  Top 0.254: IC1.25 C23.2
N$12
  Top 0.254: IC1.24 C24.2
N$13
  Top 0.254: IC1.23 C25.2
N$14
  Top 0.254: IC1.22 C26.2
N$15
  Top 0.254: IC1.21 C27.2
N$16
  Top 0.254: C30.2 28.05,33.81 C28.1 IC1.30
N$17
  Top 0.254: C28.2 27.94,35.56 26.67,36.83 25.4,36.83 IC1.31
N$18
  Top 0.254: IC1.29 C30.1
N$19
  Top 0.254: C29.2 28.05,29.1 26.67,30.48 IC1.28
N$21
  Top 0.254: IC1.27 C29.1
N$22
  Top 0.254: U$16.6 64.65,15.12 IC1.18
N$23
  Top 0.254: U$16.5 65.28,12.7 65.53,12.95 65.53,13.46 IC1.19
N$25
  Top 0.254: U$16.4 66.36,11.75 IC1.20
N$26
  Top 0.254: U2.11 36.15,40.37 U$1.P$1
  Top 0.406: U$1.P$1 35.12,42.35 33.78,43.69 30.17,43.69 D1.A
N$FOO
  Top 0.254: R7.2 C20.1 R8.1 42.16,15.75 43.43,14.48 46.9,14.48 62.99,14.48 63.5,13.97 63.5,11.43 64.14,10.79 67.94,10.79 68.58,10.16 68.58,7.62 72.39,3.81 87.12,3.81 87.63,4.32 87.63,6.6 87.63,7.11 | 87.63,7.11 87.63,7.62 | 87.63,7.62 87.63,12.19 86.87,12.95 83.06,12.95 82.8,12.7 U$3.2 | 87.63,7.11 87.63,7.62 | U7.VBUS 87.62,7.12 87.63,7.11
SI
  Top 0.254: U2.99 41.49,48.68 40.64,49.53 27.94,49.53 26.67,50.8 IC1.36
SW_POWER  (via drill 0.3)
  Top 0.254: U2.34 44.99,31.97 v44.96,32.26 | v44.96,25.65 44.96,24.64 48.26,21.34 65.02,21.34 65.53,21.34 v70.1,21.34
  Bottom 0.254: v44.96,32.26 v44.96,25.65 | v70.1,21.34 70.1,17.25 S5.1
SWDCK
  Top 0.254: U3.P$4 31.75,18.64 31.75,20.32 34.54,23.11 34.54,30.48 37.08,33.02 37.08,34.04 38.42,35.37 U2.21
SWDIO
  Top 0.254: U3.P$2 30.48,18.64 30.48,20.32 34.04,23.88 34.04,30.73 36.58,33.27 36.58,34.29 38.16,35.87 U2.20
SWV
  Top 0.254: U3.P$6 33.02,18.64 33.02,20.32 35.05,22.35 35.05,30.23 37.59,32.77 37.59,33.78 38.18,34.37 U2.23
TDI
  Top 0.254: U3.P$8 34.29,18.64 34.29,20.83 35.56,22.1 35.56,29.97 38.1,32.51 38.1,33.53 38.44,33.87 U2.24
TOUCH_1
  Top 0.254: U2.19 37.89,36.37 36.07,34.54 36.07,33.53 33.53,30.99 33.53,24.38 30.48,21.34 21.59,21.34 21.34,21.34 18.8,23.88 18.8,33.27 18.54,33.53 18.03,33.53 17.78,33.53 17.02,34.29 17.02,37.59 17.53,38.1 19.07,38.1 U$15.P$1 18.77,38.33
TOUCH_2
  Top 0.254: U2.18 37.63,36.87 35.56,34.8 35.56,33.78 33.02,31.24 33.02,24.64 30.23,21.84 21.59,21.84 19.3,24.13 19.3,33.78 19.05,34.04 18.29,34.04 18.03,34.04 17.53,34.54 17.53,37.08 17.78,37.34 18.53,37.34 18.53,37.33 U$15.P$2
TOUCH_3
  Top 0.254: 32.51,25.15 32.51,24.89 | 32.51,24.89 31.5,23.88 21.59,23.88 21.34,23.88 19.81,25.4 19.81,34.04 19.3,34.54 18.54,34.54 18.29,34.54 18.03,34.8 18.03,35.81 18.54,36.32 19.55,36.32 U$15.P$3 | U2.17 37.37,37.37 35.05,35.05 35.05,34.04 32.51,31.5 32.51,25.15 | 32.51,25.15 32.51,24.89
TOUCH_4
  Top 0.254: U2.16 37.11,37.87 34.54,35.31 34.54,34.29 32,31.75 32,25.15 31.24,24.38 21.59,24.38 21.08,24.89 20.83,25.15 20.32,25.65 20.32,34.31 U$15.P$4
V+  (via drill 0.3, 0.3 pad 0.6)
  Top 0.254: U2.13 38.1,39.37 37.47,38.73 35.97,38.73 U$1.P$2 | v21.08,31.75 21.08,61.98 22.35,63.25 52.83,63.25 55.12,60.96 IC1.1 IC1.2 IC1.3 | v13.34,31.75 13.34,10.79 14.61,9.53 59.69,9.53 60.96,10.79 C36.2 61.52,11.75 U$16.3
  Top 0.406: U$1.P$2 35.08,37.85 C7.1 32.4,36.12 C16.1 32.26,35.98 32.26,34.29 29.72,31.75 v25.4,31.75
  Bottom 0.254: v21.08,31.75 15.24,31.75 | v13.34,31.75 12.7,31.75
  Bottom 0.406: v25.4,31.75 v21.08,31.75 15.24,31.75 v13.34,31.75 12.7,31.75 7.62,31.75 6.35,31.75 JP1.2
VBUS
  Top 0.254: U2.33 44.45,31.28 44.45,30.73 44.2,30.48 44.11,30.48 43.69,30.48 42.93,29.72 42.93,21.68 R8.2
VCC  (via drill 0.3 pad 0.6)
  Top 0.254: C8.1 C11.1 | C11.1 61.2,40.4 60.96,40.64 v58.48,40.64 | v58.48,40.64 58.33,40.48 | 58.33,40.48 58.17,40.32 55.09,40.32 U2.65 47.42,40.37 v47.37,40.32 45.91,40.32 45.47,39.88 43.94,39.88 U$5.P$2 | v47.5,25.65 47.5,22.86 48.01,22.35 v54.61,22.35 | U$9.8 55.88,24.64 v55.88,24.89 | U$10.8 58.98,43.64 v58.93,43.69 | v58.48,40.64 58.33,40.48 | 61.47,38.86 60.96,39.37 60.96,39.45 C11.1
  Bottom 0.254: 47.5,40.2 v47.37,40.32 47.5,40.2 | v47.5,25.65 47.5,40.2 | v55.88,24.89 55.88,23.62 v54.61,22.35 | v58.93,43.69 58.93,41.08 v58.48,40.64
VCCD  (via drill 0.3 pad 0.6)
  Top 0.254: v48.26,32.77 47.49,32 U2.39 47.49,28.57 C34.1 C15.1 | v48.01,46.48 47.99,46.47 U2.86 47.99,49.4 C35.1
  Bottom 0.254: v48.26,32.77 48.26,41.15 47.5,41.91 47.5,45.97 v48.01,46.48
VCCIO  (via drill 0.3, 0.3 pad 0.6)
  Top 0.254: 44.7,34.54 44.7,33.02 | C12.1 40.64,45.72 44.7,45.72 | U2.100 39.77,47.42 C12.1 | 46.99,45.72 v45.72,45.72 | v45.72,45.72 44.7,45.72 | U2.75 55.04,46.59 C9.1 53.34,45.72 v52.32,45.72 | 44.7,45.72 v45.72,45.72 | U2.88 46.99,45.72 | 44.7,33.02 40.64,33.02 C13.1 39.77,31.32 | U2.50 54.21,31.32 C6.1 v53.59,32.77 | v53.59,34.54 v46.23,34.54 | v46.23,34.54 45.97,34.54 44.7,34.54 | v50.8,45.72 46.99,45.72 | 44.7,33.02 45.47,33.02 46.49,32 46.49,31.93 U2.37 46.49,29.73 46.23,29.46 45.47,29.46 45.21,29.21 45.21,28.82 C14.1 | 44.7,34.54 v46.23,34.54 | U1.5 31.5,48.01 32.85,48.01 C32.1 33.44,47.84 34.29,46.99 39.34,46.99 C12.1 | U2.26 39.77,31.32 | C17.1 32.05,11.12 30.48,12.7 30.48,14.68 U3.P$1 30.48,14.83 30.48,16.51 30.73,16.76 36.32,16.76 36.58,17.02 36.58,28.7 36.83,28.96 38.1,28.96 39.77,30.62 39.77,31.32 | v45.72,48.51 C2.1 C1.1
  Bottom 0.254: v53.59,32.77 v53.59,34.54 | v52.32,45.72 v50.8,45.72 | v46.23,34.54 46.23,37.85 45.72,38.35 45.72,41.4 46.23,41.91 46.23,45.72 v45.72,45.72 v45.72,48.51
VEE  (via drill 0.3 pad 0.6)
  Top 0.254: U2.12 37.97,39.87 37.78,39.64 32.92,39.64 C3.1 | U2.12 | 32.92,42.06 D1.C 30.8,42.23 v30.73,42.16 | U$5.P$1 U2.12 | U2.12 | IC1.34 24.55,46.14 25.65,46.14 C31.1 28.73,46.14 U1.3 28.9,45.97 29.46,45.97 29.72,46.23 29.72,47.75 29.46,48.01 U1.1
  Top 0.406: 32.92,39.64 32.92,42.06
  Bottom 0.254: v30.73,42.16 27.69,42.16 24.77,45.09 | 24.77,45.09 IC1.34 | IC1.35 IC1.34 | IC1.34 24.77,45.09
XRES
  Top 0.254: U2.15 39.61,38.37 39.88,38.1 39.88,33.02 39.62,32.77 38.86,32.77 38.86,32.51 36.07,29.72 36.07,19 U3.P$10

### Text on the board
tNames: Tinkerer's Tricorder v0.1